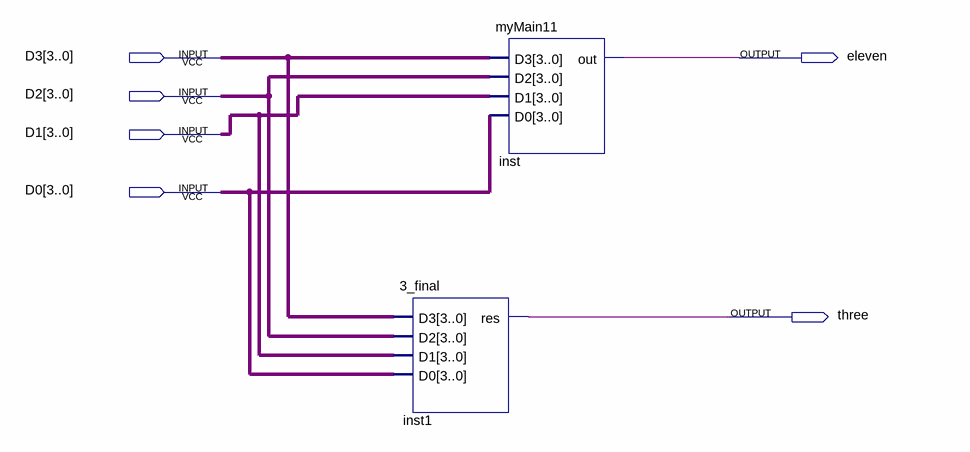
[diagram p0: schematic sheet]
// Quartus schematic AZ1FINAL.bdf as structural Verilog: 2 symbols, 6 pins
module AZ1FINAL (
  input  [3:0] D3,
  input  [3:0] D2,
  input  [3:0] D1,
  input  [3:0] D0,
  output eleven,
  output three
);

  \3_final  inst1 (.D3(D3), .D2(D2), .D1(D1), .D0(D0), .res(three));
  myMain11 inst (.D3(D3), .D2(D2), .D1(D1), .D0(D0), .out(eleven));
endmodule
